# EAGLE design COUNTER1 (EAGLE 9.6.0)
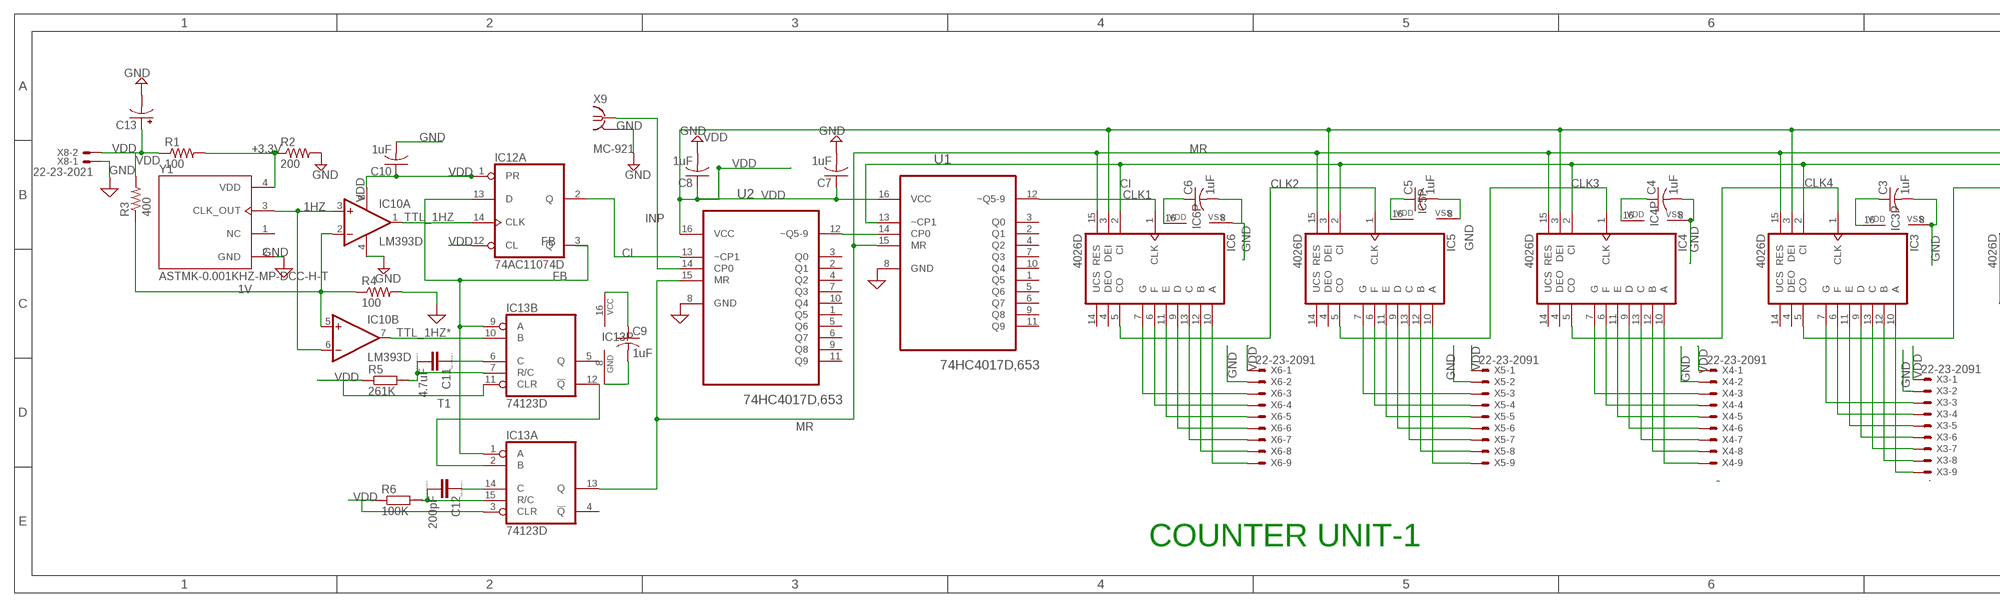
[diagram p0: schematic, sheet 1, part 1 of 2]
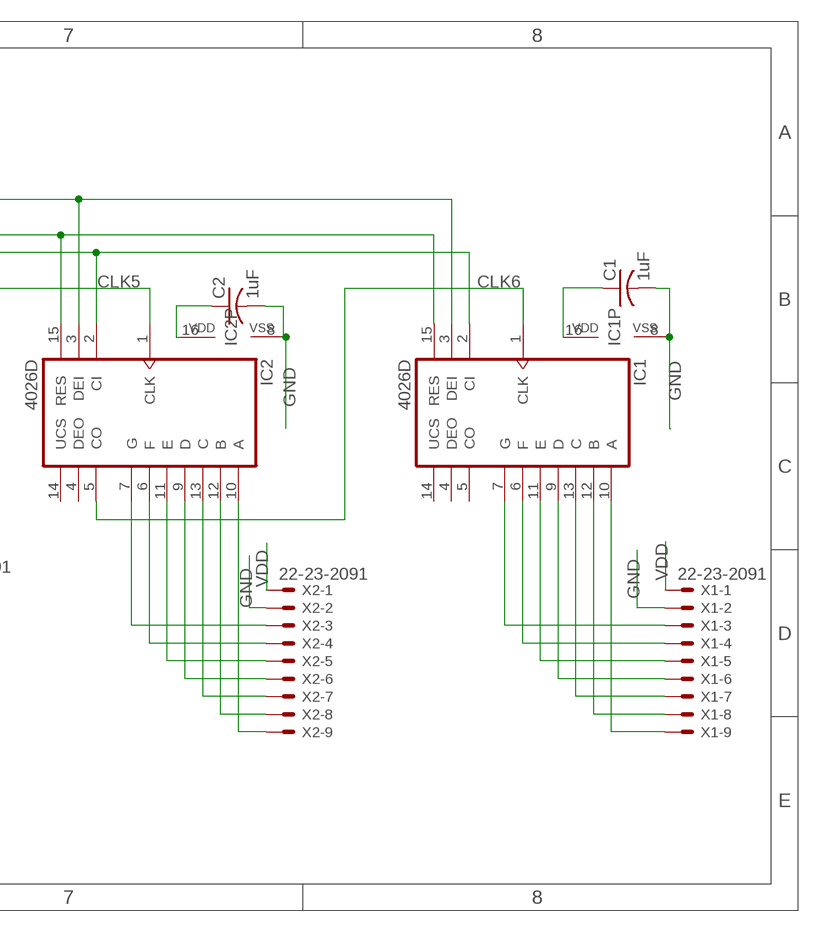
[diagram p1: schematic, sheet 1, part 2 of 2]

## Parts
C1  1uF  C-USC0603  [C0603]
C2  1uF  C-USC0603  [C0603]
C3  1uF  C-USC0603  [C0603]
C4  1uF  C-USC0603  [C0603]
C5  1uF  C-USC0603  [C0603]
C6  1uF  C-USC0603  [C0603]
C7  1uF  C-USC0603  [C0603]
C8  1uF  C-USC0603  [C0603]
C9  1uF  C-USC0603  [C0603]
C10  1uF  C-USC0603  [C0603]
C11  4.7uF  CC0603  [C0603]
C12  200pF  CC0603  [C0603]
C13  CPOL-USE2-5  [E2-5]
IC1  4026D  [SO16]
IC2  4026D  [SO16]
IC3  4026D  [SO16]
IC4  4026D  [SO16]
IC5  4026D  [SO16]
IC6  4026D  [SO16]
IC10  LM393D  [SO08]
IC12  74AC11074D  [SO14]
IC13  74123D  [SO16]
R1  100  R-US_R0603  [R0603]
R2  200  R-US_R0603  [R0603]
R3  400  R-US_R0603  [R0603]
R4  100  R-US_R0603  [R0603]
R5  261K  RR0603  [R0603]
R6  100K  RR0603  [R0603]
U1  74HC4017D,653  [SOIC127P600X175-16N]
U2  74HC4017D,653  [SOIC127P600X175-16N]
X1  22-23-2091  [22-23-2091]
X2  22-23-2091  [22-23-2091]
X3  22-23-2091  [22-23-2091]
X4  22-23-2091  [22-23-2091]
X5  22-23-2091  [22-23-2091]
X6  22-23-2091  [22-23-2091]
X8  22-23-2021  [22-23-2021]
X9  MC-921  [MC-921]
Y1  ASTMK-0.001KHZ-MP-DCC-H-T  [OSC_ASTMK-0.001KHZ-MP-DCC-H-T]

## Nets
1HZ: IC10.3(A:+IN) IC10.6(B:-IN) Y1.3(CLK_OUT)
1V: IC10.2(A:-IN) IC10.5(B:+IN) R3.1 R4.1
+3.3V: R1.2 R2.1 Y1.4(VDD)
CI: IC1.2(CI) IC2.2(CI) IC3.2(CI) IC4.2(CI) IC5.2(CI) IC6.2(CI) IC12.2(A:Q) U1.13(~CP1) U2.13(~CP1)
CLK1: IC6.1(CLK) U1.12(~Q5-9)
CLK2: IC5.1(CLK) IC6.5(CO)
CLK3: IC4.1(CLK) IC5.5(CO)
CLK4: IC3.1(CLK) IC4.5(CO)
CLK5: IC2.1(CLK) IC3.5(CO)
CLK6: IC1.1(CLK) IC2.5(CO)
FB: IC12.3(A:!Q) IC12.13(A:D) IC13.1(A:A) IC13.9(B:A)
GND: C1.2 C2.2 C3.2 C4.2 C5.2 C6.2 C7.2 C8.2 C9.2 C10.2 C13.- IC1.8(VSS) IC2.8(VSS) IC3.8(VSS) IC4.8(VSS) IC5.8(VSS) IC6.8(VSS) IC10.4(P:V-) IC13.8(P:GND) R2.2 R4.2 U1.8(GND) U2.8(GND) X1.2 X2.2 X3.2 X4.2 X5.2 X6.2 X8.1 X9.2@1(GND) X9.2@2(GND) Y1.2(GND) ; supply symbol labelled SUP
INP: U2.14(CP0) X9.1
MR: IC1.15(RES) IC2.15(RES) IC3.15(RES) IC4.15(RES) IC5.15(RES) IC6.15(RES) IC13.13(A:Q) U1.15(MR) U2.15(MR)
N$1: C11.1 IC13.6(B:C)
N$2: IC1.10(A) X1.9
N$5: IC1.12(B) X1.8
N$6: IC1.13(C) X1.7
N$7: IC1.9(D) X1.6
N$8: IC1.11(E) X1.5
N$9: IC1.6(F) X1.4
N$10: IC1.7(G) X1.3
N$11: IC2.10(A) X2.9
N$12: IC2.12(B) X2.8
N$13: IC2.13(C) X2.7
N$14: IC2.9(D) X2.6
N$15: IC2.11(E) X2.5
N$16: IC2.6(F) X2.4
N$17: IC2.7(G) X2.3
N$18: IC3.10(A) X3.9
N$24: IC3.12(B) X3.8
N$25: IC3.13(C) X3.7
N$26: IC3.9(D) X3.6
N$27: IC3.11(E) X3.5
N$28: IC3.6(F) X3.4
N$29: IC3.7(G) X3.3
N$30: IC6.12(B) X6.8
N$31: IC4.10(A) X4.9
N$32: IC4.12(B) X4.8
N$33: IC4.13(C) X4.7
N$34: IC4.9(D) X4.6
N$35: IC4.11(E) X4.5
N$36: IC4.6(F) X4.4
N$37: IC4.7(G) X4.3
N$38: IC5.10(A) X5.9
N$39: IC5.12(B) X5.8
N$40: IC5.13(C) X5.7
N$41: IC5.9(D) X5.6
N$42: IC5.11(E) X5.5
N$43: IC5.6(F) X5.4
N$44: IC5.7(G) X5.3
N$45: IC6.10(A) X6.9
N$46: IC6.13(C) X6.7
N$47: IC6.9(D) X6.6
N$48: IC6.11(E) X6.5
N$49: IC6.6(F) X6.4
N$50: IC6.7(G) X6.3
N$51: C12.1 IC13.14(A:C)
N$53: U1.14(CP0) U2.12(~Q5-9)
N$56: IC13.11(B:CLR)
RC1: C11.2 IC13.7(B:R/C) R5.2
RC2: C12.2 IC13.15(A:R/C) R6.2
T1: IC13.2(A:B) IC13.12(B:!Q)
TTL_1HZ: IC10.1(A:OUT) IC12.14(A:CLK)
TTL_1HZ*: IC10.7(B:OUT) IC13.10(B:B)
VDD: C1.1 C2.1 C3.1 C4.1 C5.1 C6.1 C7.1 C8.1 C9.1 C10.1 C13.+ IC1.3(DEI) IC1.16(VDD) IC2.3(DEI) IC2.16(VDD) IC3.3(DEI) IC3.16(VDD) IC4.3(DEI) IC4.16(VDD) IC5.3(DEI) IC5.16(VDD) IC6.3(DEI) IC6.16(VDD) IC10.8(P:V+) IC12.1(A:PR) IC12.12(A:CL) IC13.3(A:CLR) IC13.16(P:VCC) R1.1 R3.2 R5.1 R6.1 U1.16(VCC) U2.16(VCC) X1.1 X2.1 X3.1 X4.1 X5.1 X6.1 X8.2
Unconnected: IC1.4(DEO) IC1.5(CO) IC1.14(UCS) IC2.4(DEO) IC2.14(UCS) IC3.4(DEO) IC3.14(UCS) IC4.4(DEO) IC4.14(UCS) IC5.4(DEO) IC5.14(UCS) IC6.4(DEO) IC6.14(UCS) IC12.5(B:!Q) IC12.6(B:Q) IC12.7(B:PR) IC12.8(B:CLK) IC12.9(B:D) IC12.10(B:CL) IC13.4(A:!Q) IC13.5(B:Q) U1.1(Q5) U1.2(Q1) U1.3(Q0) U1.4(Q2) U1.5(Q6) U1.6(Q7) U1.7(Q3) U1.9(Q8) U1.10(Q4) U1.11(Q9) U2.1(Q5) U2.2(Q1) U2.3(Q0) U2.4(Q2) U2.5(Q6) U2.6(Q7) U2.7(Q3) U2.9(Q8) U2.10(Q4) U2.11(Q9) Y1.1(NC)

## Notes on the sheet
- COUNTER UNIT-1

## Power pins joined to a net without a drawn wire
GND: IC12.4(P:GND)
VDD: IC12.11(P:VCC)

## Library data of the parts
C1-C10 = rcl:C-US: CAPACITOR, American symbol; SPICEPREFIX: C
C11 C12 = eagle-ltspice:C: CAPACITOR, European symbol; SPICEMODEL: NONE; SPICEPREFIX: C
C13 = rcl:CPOL-US: POLARIZED CAPACITOR, American symbol; SPICEPREFIX: C
IC1-IC6 = 40xx:4026: Decade COUNTER/DIVIDER, 7-seg. outputs
IC10 = linear:LM393: COMPARATOR
IC12 = 74ac-logic:74AC11074: Dual positive edge triggered D-type FLIP FLOP
IC13 = 74xx-us:74*123: Retriggerable monostable MULTIVIBRATOR
R1-R4 = resistor:R-US_: RESISTOR, American symbol
R5 R6 = eagle-ltspice:R: RESISTOR, European symbol; SPICEMODEL: NONE; SPICEPREFIX: R
U1 U2 = 74HC4017D_653:74HC4017D,653: Johnson decade counter with 10 decoded outputs Check prices <https://pricing.snapeda.com/parts/74HC4017D%2C653/Nexperia%20USA%20Inc./view-part?ref=eda>; AVAILABILITY: Good; DESCRIPTION: Counter IC Counter, Decade 1 Element 10 Bit Positive, Negative 16-SO; MF: Nexperia USA Inc.; MP: 74HC4017D,653; PACKAGE: None; PRICE: None; PURCHASE-URL: https://pricing.snapeda.com/search/part/74HC4017D,653/?ref=eda
X1-X6 = con-molex:22-23-2091: .100" (2.54mm) Center Header - 9 Pin; MF: MOLEX; MPN: 22-23-2091; OC_FARNELL: 1756827; OC_NEWARK: 56H0450
X8 = con-molex:22-23-2021: .100" (2.54mm) Center Header - 2 Pin; MF: MOLEX; MPN: 22-23-2021; OC_FARNELL: 1462926; OC_NEWARK: 25C3832
X9 = con-coax:MC-921: COAX. MICROWAVE CONNECTOR O/D diam 2.1 Source: www.tycoelectronics.com .. Electronics .. ENG_CD_1775146_A2.pdf; OC_FARNELL: unknown; OC_NEWARK: unknown
Y1 = ASTMK-0.001KHZ-MP-DCC-H-T:ASTMK-0.001KHZ-MP-DCC-H-T: 1Hz XO (Standard) LVCMOS Oscillator 1.2V ~ 3.63V 4-SMD, No Lead Check prices <https://pricing.snapeda.com/parts/ASTMK-0.001KHZ-MP-DCC-H-T/Abracon/view-part?ref=eda>; AVAILABILITY: Warning; DESCRIPTION: 1Hz XO (Standard) LVCMOS Oscillator 1.2V ~ 3.63V 4-SMD, No Lead; MF: Abracon; MP: ASTMK-0.001KHZ-MP-DCC-H-T; PACKAGE: SMD-4 Abracon; PRICE: None; PURCHASE-URL: https://pricing.snapeda.com/search/part/ASTMK-0.001KHZ-MP-DCC-H-T/?ref=eda

## Board
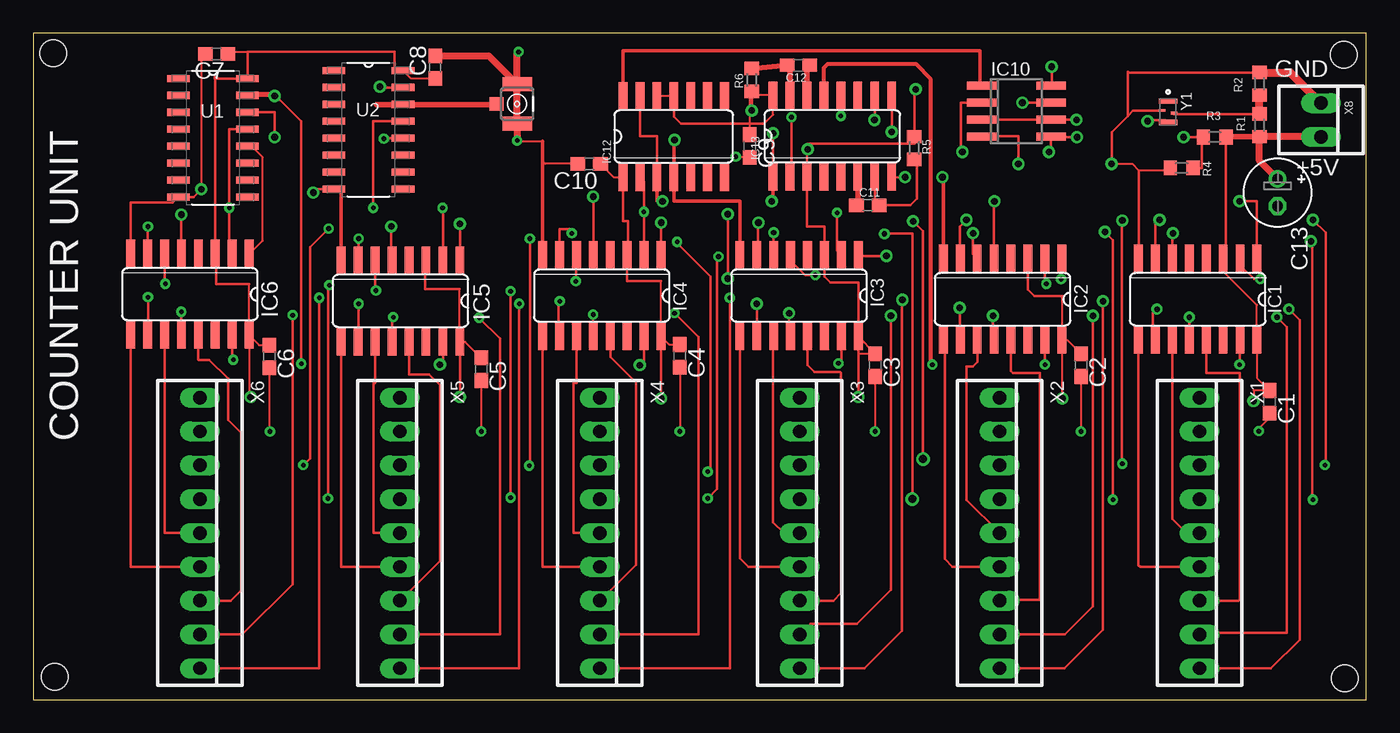
[diagram p2: board, top side]
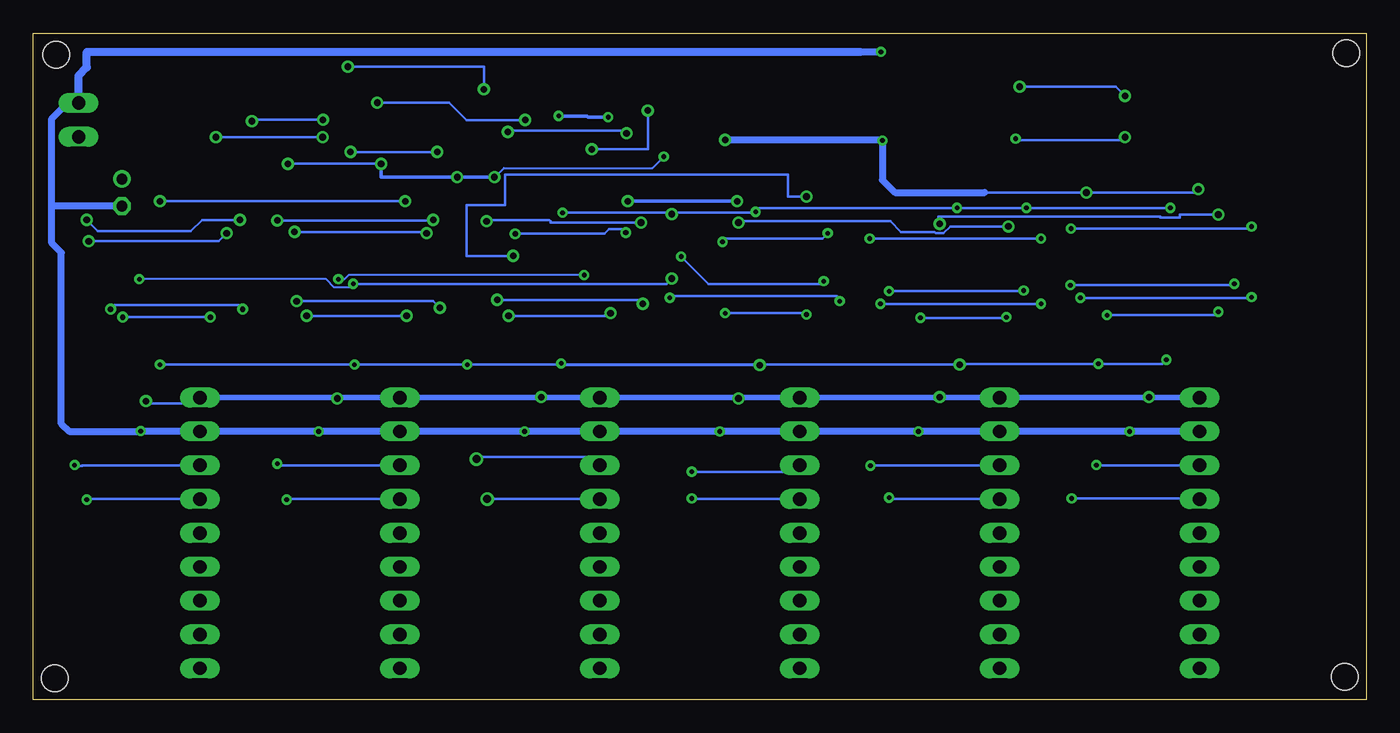
[diagram p3: board, bottom side, seen from below]

Size 100 x 50 mm. Coordinates in mm from the lower left corner, seen from the top.
Outline: 0,0 100,0 100,50 0,50 0,0
Copper layers (1*16): Top 0.035mm / dielectric 1.5mm / Bottom 0.035mm
Design rules "default": minimum track width 6mil, minimum drill 0.35mm, track to track 6mil, track to pad 6mil, pad to pad 6mil, via to via 6mil, smd to smd 6mil, copper to edge 40mil, drill to drill 6mil, minimum pad ring 10mil, minimum via ring 8mil, stop-mask expansion 4mil, vias tented up to drill 0mil, thermal gap 10mil
Holes 2 mm at 1.6,1.7 1.5,48.5 98.4,1.6 98.3,48.4

### Footprints (pad centres in the part's own frame; a part is rotated, then mirrored left to right if it is on the bottom)
C0603 = smd 1.1 x 1: 1 -0.85,0; 2 0.85,0
E2-5 = drill 0.813 pad 1.27: + -1.016,0 | drill 0.813 pad 1.27 octagon: - 1.016,0
SO16 = smd 0.66 x 2.032: 1 -4.445,-3.073; 2 -3.175,-3.073; 3 -1.905,-3.073; 4 -0.635,-3.073; 5 0.635,-3.073; 6 1.905,-3.073; 7 3.175,-3.073; 8 4.445,-3.073; 9 4.445,3.073; 10 3.175,3.073; 11 1.905,3.073; 12 0.635,3.073; 13 -0.635,3.073; 14 -1.905,3.073; 15 -3.175,3.073; 16 -4.445,3.073
SO08 = smd 0.6 x 2.2: 1 -1.905,-2.6; 2 -0.635,-2.6; 3 0.635,-2.6; 4 1.905,-2.6; 5 1.905,2.6; 6 0.635,2.6; 7 -0.635,2.6; 8 -1.905,2.6
SO14 = smd 0.66 x 2.032: 1 -3.81,-3.073; 2 -2.54,-3.073; 3 -1.27,-3.073; 4 0,-3.073; 5 1.27,-3.073; 6 2.54,-3.073; 7 3.81,-3.073; 8 3.81,3.073; 9 2.54,3.073; 10 1.27,3.073; 11 0,3.073; 12 -1.27,3.073; 13 -2.54,3.073; 14 -3.81,3.073
R0603 = smd 1 x 1.1: 1 -0.85,0; 2 0.85,0
SOIC127P600X175-16N = smd 1.702 x 0.533: 1 -2.591,4.445; 2 -2.591,3.175; 3 -2.591,1.905; 4 -2.591,0.635; 5 -2.591,-0.635; 6 -2.591,-1.905; 7 -2.591,-3.175; 8 -2.591,-4.445; 9 2.591,-4.445; 10 2.591,-3.175; 11 2.591,-1.905; 12 2.591,-0.635; 13 2.591,0.635; 14 2.591,1.905; 15 2.591,3.175; 16 2.591,4.445
22-23-2091 = drill 1 long: 1 -10.16,0; 2 -7.62,0; 3 -5.08,0; 4 -2.54,0; 5 0,0; 6 2.54,0; 7 5.08,0; 8 7.62,0; 9 10.16,0
22-23-2021 = drill 1 long: 1 -1.27,0; 2 1.27,0
MC-921 = smd 1 x 1.05: 1 0,1.528 | smd 1.05 x 2.2: 2@1 -1.475,0; 2@2 1.475,0
OSC_ASTMK-0.001KHZ-MP-DCC-H-T = smd 0.4 x 1.4: 1 -0.8,0; 3 0.8,0 | smd 0.2 x 0.5: 2 -0.1,-0.45; 4 0.1,0.45

### Placement (x,y rotation side)
C1  92.75,22.35 270 top
C2  78.6,25.1 270 top
C3  63.15,25.1 270 top
C4  48.5,25.8 270 top
C5  33.6,24.8 270 top
C6  17.7,25.75 270 top
C7  13.75,48.45 180 top
C8  30.15,47.45 90 top
C9  53.75,41.55 270 top
C10  41.7,40.2 180 top
C11  62.6,37.1 0 top
C12  57.4,47.6 180 top
C13  93.35,38.05 270 top
IC1  87.36,30.04 180 top
IC2  72.72,30.04 180 top
IC3  57.45,30.31 180 top
IC4  42.65,30.31 180 top
IC5  27.55,29.92 180 top
IC6  11.75,30.42 180 top
IC10  73.76,44.15 270 top
IC12  48.05,42.26 0 top
IC13  59.95,42.28 0 top
R1  91.99,43.09 90 top
R2  91.99,46.21 90 top
R3  88.63,42.21 0 top
R4  86.15,39.89 180 top
R5  66.1,41.4 270 top
R6  53.9,46.5 90 top
U1  13.48,42.16 0 top
U2  25.15,42.76 0 top
X1  87.5,12.5 270 top
X2  72.5,12.5 270 top
X3  57.5,12.5 270 top
X4  42.5,12.5 270 top
X5  27.5,12.5 270 top
X6  12.5,12.5 270 top
X8  96.6,43.5 270 top
X9  36.3,44.7 90 top
Y1  85.13,44.11 270 top

### Tracks (layer width: path | path; a pad name or v marks a point on that pad's centre or on a via)
1HZ  (via drill 0.5)
  Top 0.203: v78.27,43.51 v78.26,43.52 IC10.6 IC10.3 | v83.6,43.41 83.6,43.49 83.61,43.5 84.94,43.5 Y1.3
  Bottom 0.203: v83.6,43.41 83.5,43.51 v78.27,43.51
1V  (via drill 0.5)
  Top 0.203: v76.2,41.1 76.36,41.26 IC10.5 76.41,42.2 v78.3,42.2 | v69.7,41.1 69.6,41.2 69.6,44.2 69.6,44.8 71.14,44.8 IC10.2 | v86.3,42.2 v86.31,42.21 R3.1 87.68,42.11 87.68,39.89 R4.1
  Bottom 0.203: v76.2,41.1 v69.7,41.1 | v86.3,42.2 v78.3,42.2
+3.3V
  Top 0.2: R1.2 85.58,43.94 Y1.4
  Top 0.61: R1.2 R2.1
CI  (via drill 0.35, 0.5)
  Top 0.152: v92.05,31.55 91.59,31.55 90.68,32.46 90.68,33.07 IC1.2
  Top 0.2: U1.13 14.71,42.8 14.7,42.8 v14.7,36.9 14.7,33.72 IC6.2 | IC5.2 30.73,36.88 v30.7,36.9 | U2.13 25.5,43.4 v25.5,36.9 | IC4.2 45.81,33.4 v45.81,36.6 45.81,38.89 IC12.2 | IC3.2 60.3,33.71 v60.3,36.53 | IC2.2 75.89,31.3 v76,31.2 | v52.1,31.6 v52.1,36.43
  Bottom 0.152: v92.05,31.55 78.03,31.55 77.42,30.94 76.2,30.94 76.05,31.09 v76,31.2
  Bottom 0.2: v14.7,36.9 v25.5,36.9 v30.7,36.9 45.51,36.9 v45.81,36.6 45.88,36.53 52.2,36.53 | v60.3,36.53 52.2,36.53 | v76,31.2 52.5,31.2 v52.1,31.6 | v52.1,36.43 52.2,36.53
CLK1
  Top 0.152: U1.12 16.15,41.45 16.46,41.45 17.22,40.69 17.22,34.44 16.31,33.53 IC6.1
CLK2  (via drill 0.5)
  Top 0.2: IC6.5 11.1,33.49 v11.1,36.4 | v32,35.7 IC5.1
  Bottom 0.2: v11.1,36.4 13.97,36.4 13.97,36.17 15.43,36.17 15.43,36.23 32.1,36.23 32.1,35.7 v32,35.7
CLK3  (via drill 0.5)
  Top 0.2: v26.85,35.51 26.85,33.06 IC5.5 | v47.1,35.8 IC4.1
  Bottom 0.2: v26.85,35.51 31.2,35.51 31.71,34.99 32.29,34.99 32.4,35.1 34.9,35.1 35.7,35.9 47,35.9 v47.1,35.8
CLK4  (via drill 0.5)
  Top 0.2: v42,37.75 42.02,37.73 IC4.5 | v64,33.3 61.9,33.3 IC3.1
  Bottom 0.2: v42,37.75 43.4,37.75 43.4,39.4 64.59,39.4 64.59,38.39 64.6,38.39 64.6,37.1 67.5,37.1 67.5,33.3 v64,33.3
CLK5  (via drill 0.35)
  Top 0.152: v77.11,31.55 77.11,33.07 IC2.1 | v58.67,31.85 57.91,31.85 56.84,32.92 56.84,33.38 IC3.5
  Bottom 0.152: v77.11,31.55 76.66,31.55 76.35,31.85 v58.67,31.85
CLK6  (via drill 0.5)
  Top 0.2: IC2.5 72.08,37.4 v72.1,37.4 | v90.5,37.4 91.81,37.4 IC1.1
  Bottom 0.2: v72.1,37.4 v90.5,37.4
FB  (via drill 0.5)
  Top 0.203: IC12.13 45.51,42.3 46.8,42.3 46.8,39.19 IC12.3 | IC13.9 v64.4,42.6 | IC13.1 v55.5,42.5
  Top 0.254: IC13.1 55.5,37.4 v55.4,37.4 | v47.2,37.4 46.78,37.4 IC12.3
  Bottom 0.203: v64.4,42.6 64.4,42.7 55.7,42.7 v55.5,42.5
  Bottom 0.254: v55.4,37.4 v47.2,37.4
GND  (via drill 0.35, 0.5)
  Top 0.152: v91.94,20.15 91.94,20.35 92.75,21.16 C1.2 | C2.2 v78.6,20.12 | C3.2 v63.15,20.12 | R4.2 85.11,39.7 82.95,39.7 82.45,40.2 v80.9,40.2 | C4.2 v48.5,20.12 | C5.2 v33.6,20.12 | C6.2 17.7,20.25 17.8,20.15 17.77,20.12 v17.75,20.12 | C7.2 12.6,48.15 v12.6,38.3 | v52.7,40.75 53.7,40.75 C9.2 | C10.2 38.41,40.2 38.2,40.4 | v65.4,39.2 IC13.8 | 36.3,48.51 v36.4,48.61 | X9.2@1 36.3,41.92 36.31,41.91 38.2,41.91
  Top 0.2: U2.8 21.27,38.31 v21,38.05 | v12.6,38.3 12.02,37.72 U1.8
  Top 0.203: Y1.2 82.51,44.21 82.1,43.8 | 82.95,39.7 82.95,33.15 IC1.8 | R2.2 82.14,47.06 82.1,47.1 82.1,43.8 | U1.8 10.47,37.3 7.3,37.3 IC6.8 | IC10.4 71.22,42.3 73.9,42.3 v73.9,40.2 | v80.9,40.2 80.9,42.6 82.1,43.8
  Top 0.254: v48.1,42 48.05,42 IC12.4 48.05,37.4 53.01,37.4 IC3.8 | IC2.8 68.28,39.2 v68.2,39.2 | 38.2,41.91 38.2,40.4 IC4.8 | U2.8 23.11,38.31 IC5.8
  Top 0.508: X9.2@2 34.17,48.3 C8.2 | X9.2@2 36.3,48.51 | v36.3,41.95 X9.2@1 X9.2@2
  Top 0.61: R2.2 94.31,47.06 X8.1
  Bottom 0.152: 91.97,20.12 v91.94,20.15 | 87.53,20.15 X1.2 | v65.4,39.2 64.7,39.9 53.55,39.9 v52.7,40.75 | 37.95,48.6 37.94,48.61 | v36.3,41.95 36.35,42
  Bottom 0.2: v12.6,38.3 12.85,38.05 v21,38.05 28.62,38.05
  Bottom 0.203: v73.9,40.2 v80.9,40.2
  Bottom 0.254: v65.4,39.2 v68.2,39.2 73.9,39.2 v73.9,40.2
  Bottom 0.305: 98.55,37.03 98.61,37.1
  Bottom 0.508: X6.2 v17.75,20.12 X5.2 v33.6,20.12 X4.2 v48.5,20.12 X3.2 v63.15,20.12 X2.2 v78.6,20.12 X1.2 | 36.35,42 v48.1,42 | 91.97,20.12 97.32,20.12 97.9,20.7 97.9,33.53 98.61,34.25 98.61,37.1 98.61,43.61 97.45,44.77 X8.1 | v91.94,20.15 87.53,20.15 | C13.- 98.55,37.03 | v36.3,41.95 36.3,39 35.35,38.05 28.62,38.05 | 37.94,48.61 v36.4,48.61
  Bottom 0.61: X8.1 96.6,46.82 95.98,47.44 95.98,48.6 37.95,48.6
INP
  Top 0.2: U2.14 25.73,44.66 25.75,44.65
  Top 0.406: 25.75,44.65 34.82,44.65
  Top 0.508: X9.1 34.82,44.65
MR  (via drill 0.35, 0.5)
  Top 0.203: IC1.15 90.53,25.04 90.5,25 v90.5,25.13 | v20.1,25.2 20.1,43.4 18,45.5 16.24,45.5 U1.15 18.07,45.34 v18.1,45.3 | v26,46 26.07,45.94 U2.15 | IC5.15 30.73,25.23 30.5,25 v30.5,25.13 | IC6.15 14.93,25.57 v15,25.5 | IC4.15 45.83,25.43 v45.5,25.1 | IC3.15 60.62,25.32 60.4,25.1 v60.4,25.23 | IC2.15 v75.9,25.13
  Top 0.305: IC13.13 59.31,47.41 59.6,47.7 66.2,47.7 67.3,46.6 67.3,25.28 v67.45,25.13
  Bottom 0.203: v26,46 18.8,46 v18.1,45.3 | 19.07,25.18 19,25.18 | v30.5,25.13 30.45,25.18 20.1,25.18 v20.1,25.2 15.3,25.2 v15,25.5 | v30.5,25.13 v67.45,25.13 v75.9,25.13 v90.5,25.13 | v30.5,25.13 45.5,25.13 v45.5,25.1 60.27,25.1 v60.4,25.23
N$1
  Top 0.406: IC13.6 61.85,37.1 C11.1
N$2  (via drill 0.4)
  Top 0.2: X1.9 92.84,2.34 95,4.5 95,28.5 v94.2,29.3 | v84.3,29.3 84,29 84,27.15 IC1.10
  Bottom 0.2: v84.3,29.3 84.6,29.6 93.9,29.6 v94.2,29.3
N$5  (via drill 0.4)
  Top 0.2: X1.8 87.62,5 94.05,5 94.05,27.95 v93.3,28.7 | v86.72,28.7 IC1.12
  Bottom 0.2: v93.3,28.7 v86.72,28.7
N$6
  Top 0.2: IC1.13 88,24.5 90.5,24.5 90.5,7.5 90.42,7.42 X1.7
N$7
  Top 0.2: X1.6 83.04,9.96 82.92,10.09 IC1.9
N$8
  Top 0.2: X1.5 86.5,12.5 85.45,13.54 IC1.11
N$9  (via drill 0.35, 0.5)
  Top 0.2: v96,15 95.95,15.05 95.95,34.3 v95.85,34.4 | v85.5,35 85.45,34.95 IC1.6
  Bottom 0.2: X1.4 95.96,15.04 v96,15 | v95.85,34.4 86.1,34.4 v85.5,35
N$10  (via drill 0.35, 0.5)
  Top 0.2: v96.9,17.6 96.95,17.65 96.95,35.05 v96,36 | v84.5,36 84.19,35.69 IC1.7
  Bottom 0.2: X1.3 96.32,17.58 96.35,17.55 96.85,17.55 v96.9,17.6 | v96,36 95.15,35.15 88.2,35.15 87.35,36 v84.5,36
N$11  (via drill 0.5)
  Top 0.2: X2.9 77.34,2.34 80.25,5.25 v80.25,29.9 | v69.5,29.4 69.5,27.01 IC2.10
  Bottom 0.2: v80.25,29.9 70,29.9 v69.5,29.4
N$12  (via drill 0.5)
  Top 0.2: X2.8 77.38,4.88 79.5,7 v79.5,28.8 | v72,28.8 72,27.05 IC2.12
  Bottom 0.2: v79.5,28.8 v72,28.8
N$13
  Top 0.2: X2.7 72.58,7.5 75.5,7.5 75.5,24.5 73.5,24.5 73.36,24.64 IC2.13
N$14
  Top 0.2: X2.6 68.96,9.96 68.38,10.54 68.38,26.87 IC2.9
N$15
  Top 0.2: X2.5 70,15 70,25 70.5,25 70.81,25.32 IC2.11
N$16  (via drill 0.35, 0.5)
  Top 0.2: v80.4,35.1 81,34.5 v81,15 | v70.5,35 70.5,33.43 IC2.6
  Bottom 0.2: X2.4 80.96,15.04 v81,15 | v80.4,35.1 70.6,35.1 v70.5,35
N$17  (via drill 0.35, 0.5)
  Top 0.2: v81.7,17.7 81.65,17.75 81.65,35.9 v81.7,35.95 | v70,36 69.5,35.5 69.5,33.16 IC2.7
  Bottom 0.2: X2.3 81.58,17.58 v81.7,17.7 | v81.7,35.95 70.05,35.95 v70,36
N$18  (via drill 0.5)
  Top 0.2: X3.9 62.34,2.34 65.15,5.15 65.15,29.95 v65.2,30 | v54.27,29.7 IC3.10
  Bottom 0.2: v65.2,30 54.58,30 v54.27,29.7
N$24  (via drill 0.5)
  Top 0.2: X3.8 58.32,5.7 61.8,5.7 64.35,8.25 v64.35,28.8 | v56.7,29 56.7,27.35 IC3.12
  Bottom 0.2: v64.35,28.8 56.9,28.8 v56.7,29
N$25
  Top 0.2: X3.7 60.02,7.42 60.6,8 60.6,24.5 60.5,24.6 58.6,24.6 58.09,25.11 IC3.13
N$26
  Top 0.2: X3.6 53.64,9.96 53,10.6 IC3.9
N$27
  Top 0.2: X3.5 56.3,12.5 55.5,13.3 55.5,27.19 IC3.11
N$28  (via drill 0.4, 0.6)
  Top 0.203: v55.55,35.05 IC3.6 | v63.85,34.95 65.95,34.95 v65.95,15.05
  Bottom 0.2: v65.95,15.05 65.92,15.07 65.89,15.04 X3.4
  Bottom 0.203: v55.55,35.05 55.55,35.1 55.75,35.3 56.8,35.3 57.15,34.95 v63.85,34.95
N$29  (via drill 0.5, 0.6)
  Top 0.2: v66,35.9 66.75,35.15 v66.75,18.05 | IC3.7 54.36,33.47 54.36,35.76 v54.4,35.8
  Bottom 0.2: X3.3 58.12,18.2 66.75,18.2 v66.75,18.05 | v66,35.9 65.9,36 61.3,36 61.2,35.9
  Bottom 0.203: 61.2,35.9 61.2,35.8 56.31,35.8 v54.4,35.8
N$30  (via drill 0.35)
  Top 0.2: X6.8 15.68,4.88 19.45,8.65 v19.45,28.85 | v11.1,29.1 11.1,27.36 IC6.12
  Bottom 0.2: v19.45,28.85 11.35,28.85 v11.1,29.1
N$31  (via drill 0.35)
  Top 0.2: X4.9 52.25,2.34 v52.25,30.15 | IC4.10 39.4,27.31 39.4,29.8 v39.5,29.9
  Bottom 0.2: v52.25,30.15 52.1,30.3 39.7,30.3 39.5,30.1 v39.5,29.9
N$32  (via drill 0.35)
  Top 0.2: X4.8 49.9,4.88 49.9,27.2 v48.1,29 | v42,28.9 42,27.24 IC4.12
  Bottom 0.2: v48.1,29 42,29 v42,28.9
N$33
  Top 0.2: X4.7 45.2,10.12 45.2,23.8 43.3,25.7 43.3,27.22 IC4.13
N$34
  Top 0.2: X4.6 38.2,9.96 IC4.9
N$35
  Top 0.2: IC4.11 40.74,23.77 40.54,23.77 40.54,12.5 X4.5
N$36  (via drill 0.35)
  Top 0.2: v50.6,15.1 51.3,15.8 51.3,33.15 v51.4,33.25 | v40.7,31.4 40.7,33.38 IC4.6
  Bottom 0.2: v50.6,15.1 50.54,15.04 X4.4 | v51.4,33.25 49.35,31.2 40.9,31.2 v40.7,31.4
N$37  (via drill 0.35)
  Top 0.2: v50.6,17.1 50.8,17.3 50.8,31.75 48.3,34.25 v48.3,34.35 | IC4.7 39.48,35.3 40.4,35.3 v40.4,35
  Bottom 0.2: v50.6,17.1 42.98,17.1 X4.3 | v40.4,35 40.8,34.6 48.05,34.6 v48.3,34.35
N$38  (via drill 0.35)
  Top 0.2: X5.9 36.45,2.34 v36.45,29.7 | v24.4,29.7 24.4,26.85 IC5.10
  Bottom 0.2: v36.45,29.7 v24.4,29.7
N$39  (via drill 0.35)
  Top 0.2: IC5.12 26.91,28.7 v27,28.7 | v33.45,28.65 35,27.1 35,4.88 X5.8
  Bottom 0.2: v33.45,28.65 27.05,28.65 v27,28.7
N$40
  Top 0.2: X5.7 30.5,10.42 30.5,23.6 29.7,24.4 28.2,24.4 28.18,24.41 IC5.13
N$41
  Top 0.2: X5.6 23.11,9.96 IC5.9
N$42
  Top 0.2: IC5.11 25.64,23.77 25.54,23.77 25.54,12.5 X5.5
N$43  (via drill 0.35)
  Top 0.2: v35.8,30.65 v35.8,15.15 | v25.7,30.7 25.64,30.7 IC5.6
  Bottom 0.2: v35.8,15.15 35.69,15.04 X5.4 | v35.8,30.65 25.7,30.65 v25.7,30.7
N$44  (via drill 0.35)
  Top 0.2: v37.25,34.6 37.25,17.6 v37.2,17.55 | v24.4,34.6 24.4,32.99 IC5.7
  Bottom 0.2: X5.3 37.2,17.58 v37.2,17.55 | v37.25,34.6 v24.4,34.6
N$45  (via drill 0.35)
  Top 0.2: X6.9 21.45,2.34 v21.45,30.15 | v8.6,30.2 8.6,27.35 IC6.10
  Bottom 0.2: v21.45,30.15 20.7,30.15 20.68,30.13 8.6,30.13 v8.6,30.2
N$46
  Top 0.2: X6.7 14.82,7.42 15.6,8.2 15.6,20 14.6,21 14.6,24.1 13.2,25.5 12.4,25.5 12.38,25.52 IC6.13
N$47
  Top 0.2: X6.6 7.3,9.96 IC6.9
N$48
  Top 0.2: X6.5 9.85,12.5 IC6.11
N$49  (via drill 0.35)
  Top 0.2: v22.1,15.1 22.1,31.1 v22.2,31.1 | v9.9,31.2 9.85,31.2 IC6.6
  Bottom 0.2: X6.4 12.5,15.1 v22.1,15.1 | v22.2,31.1 9.9,31.1 v9.9,31.2
N$50  (via drill 0.35)
  Top 0.2: v20.25,17.6 20.75,18.1 20.75,33.95 v22.15,35.35 | IC6.7 8.57,35.5 v8.6,35.5
  Bottom 0.2: v20.25,17.6 20.23,17.58 X6.3 | v22.15,35.35 8.75,35.35 v8.6,35.5
N$51
  Top 0.406: IC13.14 58.05,47.6 C12.1
N$53  (via drill 0.35, 0.5)
  Top 0.2: U1.14 18.1,44.06 v18.1,42.2 | v26.3,42.1 26.32,42.12 U2.12
  Bottom 0.2: v26.3,42.1 26.2,42 18.5,42 18.3,42.2 v18.1,42.2
  Bottom 0.203: 18.5,42 18.3,42 v18.1,42.2
RC1
  Top 0.2: R5.2 66.3,40.35 66.3,37.6 65.8,37.1 C11.2 63.12,37.1 IC13.7
RC2
  Top 0.406: R6.2 C12.2 56.77,47.6 IC13.15
T1  (via drill 0.35)
  Top 0.203: v56.88,43.7 56.88,39.31 IC13.2
  Top 0.406: IC13.12 v60.59,43.8
  Bottom 0.254: v60.59,43.8 58.48,43.8 58.38,43.7 v56.88,43.7
TTL_1HZ
  Top 0.254: IC10.1 71,46.05 71,48.7 44.24,48.7 IC12.14
TTL_1HZ*  (via drill 0.5)
  Top 0.203: IC13.10 63.12,43.52 v63.1,43.5 | v74.2,44.8 76.34,44.8 IC10.7
  Bottom 0.203: v63.1,43.5 67.5,43.5 68.8,44.8 v74.2,44.8
VDD  (via drill 0.5)
  Top 0.152: v91.55,22.4 91.55,23.2 C1.1 91.81,24.14 IC1.16 91.81,29.6 | v77.2,22.6 77.17,22.64 IC2.16 | IC2.16 77.58,26.97 C2.1 | IC3.16 63.15,25.98 C3.1 61.9,25.95 | IC6.16 16.94,26.6 C6.1 | IC6.16 16.2,22.8 | IC5.16 32.4,26.85 C5.1 | IC2.16 77.2,27 77.2,30.3 | IC6.16 16.2,31.2 | IC5.16 32,30.8 | IC4.16 47.68,26.65 C4.1 | IC4.16 47.09,31.4 | IC4.16 | IC5.16 | C7.1 14.75,48.6 16.07,48.6 | C8.1 28.35,46.6 U2.16 | 55.51,43.91 IC13.16 54.2,45.35 R6.1 53.75,45.5 C9.1 | IC12.1 43.56,39.19 C10.1 | IC12.12 IC12.11
  Top 0.2: 16.2,22.8 v16.3,22.7 | v32,22.7 IC5.16 | v47.1,22.6 IC4.16 | v61.9,22.7 61.9,25.95 61.9,31.3 59.8,31.3 59.35,31.75 IC3.3 59.35,35.5 58.05,35.5 IC13.3 58.05,41.3 v58.1,41.3 58.1,41.7 66.1,41.7 R5.1 66.1,45.8 v66.2,45.8 | 91.8,29.6 89.27,32.13 IC1.3 89.48,33.11 R3.2 | IC2.3 74.62,30.77 75.1,30.3 77.2,30.3 | 47.09,31.4 44.55,31.4 IC4.3 44.6,33.38 44.6,35.9 44.24,35.9 IC12.1 | IC5.3 29.4,32.99 29.4,30.8 32,30.8 | 16.2,31.2 13.7,31.2 13.7,33.49 IC6.3 13.65,46.7 13.6,46.7 13.6,46.6 U1.16 16.07,48.6 27.1,48.6 27.1,47.2 U2.16 | v53.9,44.21 R6.1 | v76.4,47.5 76.4,46.05 IC10.8 | 55.51,43.91 54.8,43.2 48.6,43.2 48.05,43.75 IC12.11
  Top 0.203: 91.81,29.6 91.8,29.6
  Top 0.406: R1.1 89.48,42.24 R3.2
  Top 0.508: X8.2 R1.1 91.99,40.43 C13.+
  Bottom 0.2: X6.1 12.7,22.66 16.14,22.66 16.2,22.6 v16.3,22.7 | X5.1 31.96,22.66 v32,22.7 | X4.1 47.04,22.66 v47.1,22.6 | X3.1 61.86,22.66 v61.9,22.7 | X2.1 72.6,22.66 77.14,22.66 v77.2,22.6 | v91.55,22.4 91.36,22.21 87.95,22.21 X1.1 | v58.1,41.3 53.9,41.3 v53.9,44.21 | v66.2,45.8 66.2,47.5 v76.4,47.5
  Bottom 0.406: X1.1 72.6,22.66 | X2.1 X3.1 X4.1 X5.1 12.7,22.66

### Text on the board
tNames: GND | +5V | COUNTER UNIT